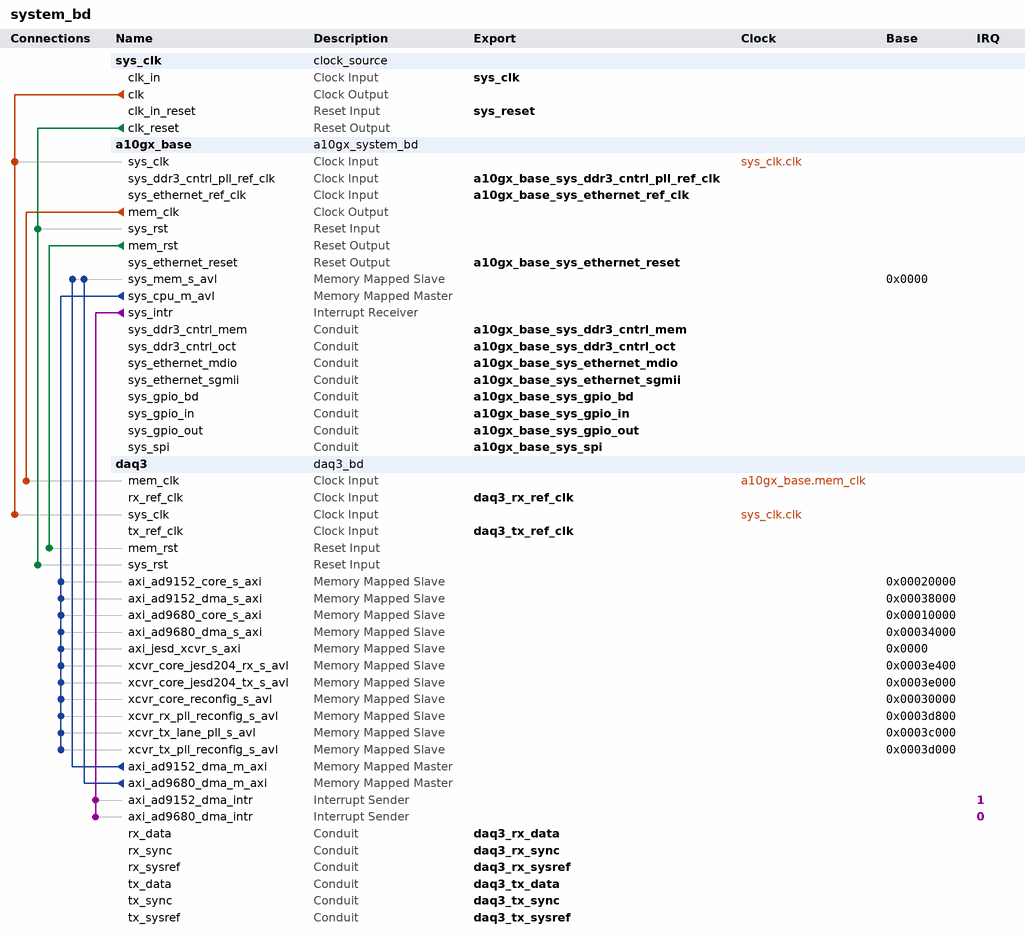
[diagram p0: system contents]
# Platform Designer (Qsys) system system_bd, Arria 10 10AX115S3F45E2SGE3
# Parameters at their usual value, and those the tool derives, are not listed.
package require -exact qsys 15.1
create_system system_bd
set_project_property DEVICE_FAMILY {Arria 10}
set_project_property DEVICE 10AX115S3F45E2SGE3

add_instance sys_clk clock_source 15.1
set_instance_parameter_value sys_clk clockFrequency 100000000

add_instance a10gx_base a10gx_system_bd 1.0

add_instance daq3 daq3_bd 1.0

# connections
add_connection a10gx_base.mem_clk daq3.mem_clk clock
add_connection sys_clk.clk a10gx_base.sys_clk clock
add_connection sys_clk.clk daq3.sys_clk clock
add_connection a10gx_base.mem_rst daq3.mem_rst reset
add_connection sys_clk.clk_reset a10gx_base.sys_rst reset
add_connection sys_clk.clk_reset daq3.sys_rst reset
add_connection a10gx_base.sys_cpu_m_avl daq3.axi_ad9152_core_s_axi avalon
set_connection_parameter_value a10gx_base.sys_cpu_m_avl/daq3.axi_ad9152_core_s_axi baseAddress 0x00020000
add_connection a10gx_base.sys_cpu_m_avl daq3.axi_ad9152_dma_s_axi avalon
set_connection_parameter_value a10gx_base.sys_cpu_m_avl/daq3.axi_ad9152_dma_s_axi baseAddress 0x00038000
add_connection a10gx_base.sys_cpu_m_avl daq3.axi_ad9680_core_s_axi avalon
set_connection_parameter_value a10gx_base.sys_cpu_m_avl/daq3.axi_ad9680_core_s_axi baseAddress 0x00010000
add_connection a10gx_base.sys_cpu_m_avl daq3.axi_ad9680_dma_s_axi avalon
set_connection_parameter_value a10gx_base.sys_cpu_m_avl/daq3.axi_ad9680_dma_s_axi baseAddress 0x00034000
add_connection a10gx_base.sys_cpu_m_avl daq3.axi_jesd_xcvr_s_axi avalon
set_connection_parameter_value a10gx_base.sys_cpu_m_avl/daq3.axi_jesd_xcvr_s_axi baseAddress 0x0000
add_connection a10gx_base.sys_cpu_m_avl daq3.xcvr_core_jesd204_rx_s_avl avalon
set_connection_parameter_value a10gx_base.sys_cpu_m_avl/daq3.xcvr_core_jesd204_rx_s_avl baseAddress 0x0003e400
add_connection a10gx_base.sys_cpu_m_avl daq3.xcvr_core_jesd204_tx_s_avl avalon
set_connection_parameter_value a10gx_base.sys_cpu_m_avl/daq3.xcvr_core_jesd204_tx_s_avl baseAddress 0x0003e000
add_connection a10gx_base.sys_cpu_m_avl daq3.xcvr_core_reconfig_s_avl avalon
set_connection_parameter_value a10gx_base.sys_cpu_m_avl/daq3.xcvr_core_reconfig_s_avl baseAddress 0x00030000
add_connection a10gx_base.sys_cpu_m_avl daq3.xcvr_rx_pll_reconfig_s_avl avalon
set_connection_parameter_value a10gx_base.sys_cpu_m_avl/daq3.xcvr_rx_pll_reconfig_s_avl baseAddress 0x0003d800
add_connection a10gx_base.sys_cpu_m_avl daq3.xcvr_tx_lane_pll_s_avl avalon
set_connection_parameter_value a10gx_base.sys_cpu_m_avl/daq3.xcvr_tx_lane_pll_s_avl baseAddress 0x0003c000
add_connection a10gx_base.sys_cpu_m_avl daq3.xcvr_tx_pll_reconfig_s_avl avalon
set_connection_parameter_value a10gx_base.sys_cpu_m_avl/daq3.xcvr_tx_pll_reconfig_s_avl baseAddress 0x0003d000
add_connection daq3.axi_ad9152_dma_m_axi a10gx_base.sys_mem_s_avl avalon
set_connection_parameter_value daq3.axi_ad9152_dma_m_axi/a10gx_base.sys_mem_s_avl baseAddress 0x0000
add_connection daq3.axi_ad9680_dma_m_axi a10gx_base.sys_mem_s_avl avalon
set_connection_parameter_value daq3.axi_ad9680_dma_m_axi/a10gx_base.sys_mem_s_avl baseAddress 0x0000
add_connection a10gx_base.sys_intr daq3.axi_ad9152_dma_intr interrupt
set_connection_parameter_value a10gx_base.sys_intr/daq3.axi_ad9152_dma_intr irqNumber 1
add_connection a10gx_base.sys_intr daq3.axi_ad9680_dma_intr interrupt
set_connection_parameter_value a10gx_base.sys_intr/daq3.axi_ad9680_dma_intr irqNumber 0

# exported interfaces
add_interface a10gx_base_sys_ddr3_cntrl_mem conduit end
set_interface_property a10gx_base_sys_ddr3_cntrl_mem EXPORT_OF a10gx_base.sys_ddr3_cntrl_mem
add_interface a10gx_base_sys_ddr3_cntrl_oct conduit end
set_interface_property a10gx_base_sys_ddr3_cntrl_oct EXPORT_OF a10gx_base.sys_ddr3_cntrl_oct
add_interface a10gx_base_sys_ddr3_cntrl_pll_ref_clk clock sink
set_interface_property a10gx_base_sys_ddr3_cntrl_pll_ref_clk EXPORT_OF a10gx_base.sys_ddr3_cntrl_pll_ref_clk
add_interface a10gx_base_sys_ethernet_mdio conduit end
set_interface_property a10gx_base_sys_ethernet_mdio EXPORT_OF a10gx_base.sys_ethernet_mdio
add_interface a10gx_base_sys_ethernet_ref_clk clock sink
set_interface_property a10gx_base_sys_ethernet_ref_clk EXPORT_OF a10gx_base.sys_ethernet_ref_clk
add_interface a10gx_base_sys_ethernet_reset reset source
set_interface_property a10gx_base_sys_ethernet_reset EXPORT_OF a10gx_base.sys_ethernet_reset
add_interface a10gx_base_sys_ethernet_sgmii conduit end
set_interface_property a10gx_base_sys_ethernet_sgmii EXPORT_OF a10gx_base.sys_ethernet_sgmii
add_interface a10gx_base_sys_gpio_bd conduit end
set_interface_property a10gx_base_sys_gpio_bd EXPORT_OF a10gx_base.sys_gpio_bd
add_interface a10gx_base_sys_gpio_in conduit end
set_interface_property a10gx_base_sys_gpio_in EXPORT_OF a10gx_base.sys_gpio_in
add_interface a10gx_base_sys_gpio_out conduit end
set_interface_property a10gx_base_sys_gpio_out EXPORT_OF a10gx_base.sys_gpio_out
add_interface a10gx_base_sys_spi conduit end
set_interface_property a10gx_base_sys_spi EXPORT_OF a10gx_base.sys_spi
add_interface daq3_rx_data conduit end
set_interface_property daq3_rx_data EXPORT_OF daq3.rx_data
add_interface daq3_rx_ref_clk clock sink
set_interface_property daq3_rx_ref_clk EXPORT_OF daq3.rx_ref_clk
add_interface daq3_rx_sync conduit end
set_interface_property daq3_rx_sync EXPORT_OF daq3.rx_sync
add_interface daq3_rx_sysref conduit end
set_interface_property daq3_rx_sysref EXPORT_OF daq3.rx_sysref
add_interface daq3_tx_data conduit end
set_interface_property daq3_tx_data EXPORT_OF daq3.tx_data
add_interface daq3_tx_ref_clk clock sink
set_interface_property daq3_tx_ref_clk EXPORT_OF daq3.tx_ref_clk
add_interface daq3_tx_sync conduit end
set_interface_property daq3_tx_sync EXPORT_OF daq3.tx_sync
add_interface daq3_tx_sysref conduit end
set_interface_property daq3_tx_sysref EXPORT_OF daq3.tx_sysref
add_interface sys_clk clock sink
set_interface_property sys_clk EXPORT_OF sys_clk.clk_in
add_interface sys_reset reset sink
set_interface_property sys_reset EXPORT_OF sys_clk.clk_in_reset

set_interconnect_requirement {$system} qsys_mm.clockCrossingAdapter FIFO
set_interconnect_requirement {$system} qsys_mm.insertDefaultSlave false
set_interconnect_requirement {$system} qsys_mm.maxAdditionalLatency 2

save_system system_bd.qsys
